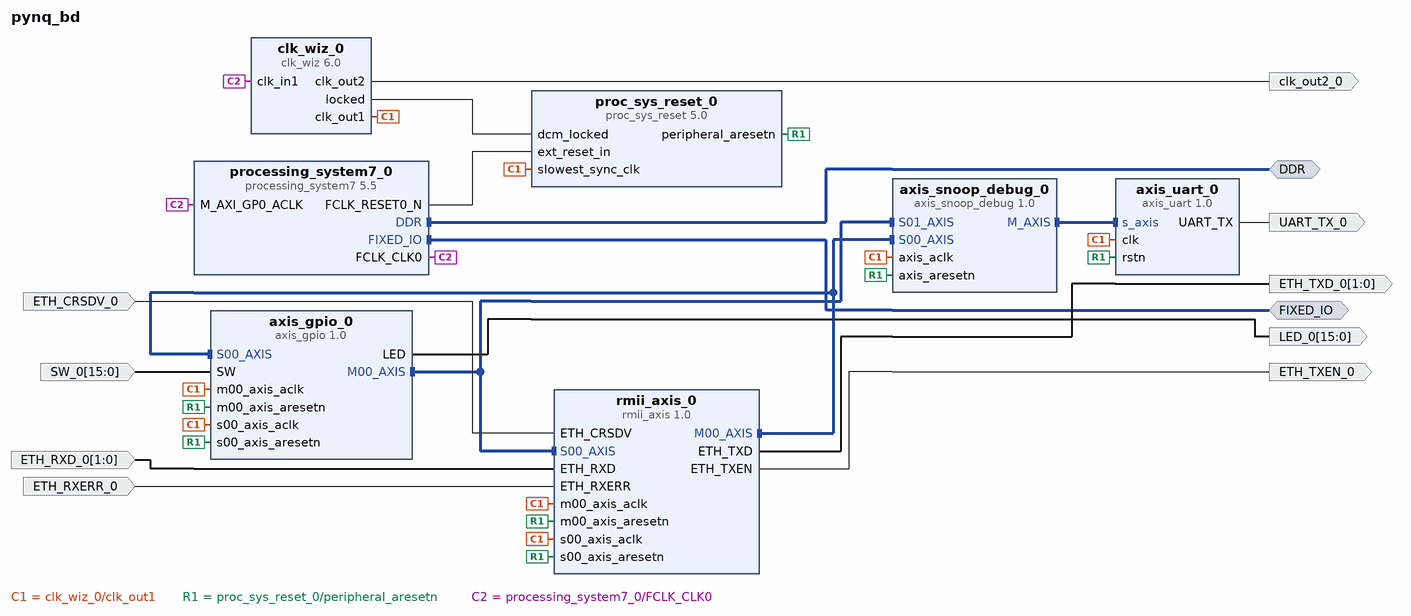
[diagram p0: block diagram of the top level]
# Vivado block design pynq_bd, xc7z020clg400-1, Vivado 2022.2
create_bd_design pynq_bd

create_bd_intf_port -mode Master -vlnv xilinx.com:interface:ddrx_rtl:1.0 DDR
create_bd_intf_port -mode Master -vlnv xilinx.com:display_processing_system7:fixedio_rtl:1.0 FIXED_IO
create_bd_port -dir O -type clk clk_out2_0
create_bd_port -dir O -from 1 -to 0 ETH_TXD_0
create_bd_port -dir O ETH_TXEN_0
create_bd_port -dir I ETH_CRSDV_0
create_bd_port -dir I ETH_RXERR_0
create_bd_port -dir I -from 1 -to 0 ETH_RXD_0
create_bd_port -dir O UART_TX_0
create_bd_port -dir I -from 15 -to 0 SW_0
create_bd_port -dir O -from 15 -to 0 LED_0

create_bd_cell -type ip -vlnv xilinx.com:ip:processing_system7:5.5 processing_system7_0
set_property -dict [list \
  CONFIG.PCW_APU_PERIPHERAL_FREQMHZ 650 \
  CONFIG.PCW_CRYSTAL_PERIPHERAL_FREQMHZ 50 \
  CONFIG.PCW_ENET0_ENET0_IO {MIO 16 .. 27} \
  CONFIG.PCW_ENET0_GRP_MDIO_ENABLE 1 \
  CONFIG.PCW_ENET0_GRP_MDIO_IO {MIO 52 .. 53} \
  CONFIG.PCW_ENET0_PERIPHERAL_ENABLE 1 \
  CONFIG.PCW_ENET0_RESET_ENABLE 1 \
  CONFIG.PCW_ENET0_RESET_IO {MIO 9} \
  CONFIG.PCW_ENET_RESET_ENABLE 1 \
  CONFIG.PCW_ENET_RESET_SELECT {Share reset pin} \
  CONFIG.PCW_FPGA0_PERIPHERAL_FREQMHZ 100 \
  CONFIG.PCW_FPGA1_PERIPHERAL_FREQMHZ 50 \
  CONFIG.PCW_GPIO_MIO_GPIO_ENABLE 1 \
  CONFIG.PCW_GPIO_MIO_GPIO_IO MIO \
  CONFIG.PCW_I2C_RESET_ENABLE 1 \
  CONFIG.PCW_M_AXI_GP0_FREQMHZ 10 \
  CONFIG.PCW_PERIPHERAL_BOARD_PRESET None \
  CONFIG.PCW_PRESET_BANK1_VOLTAGE {LVCMOS 1.8V} \
  CONFIG.PCW_QSPI_GRP_FBCLK_ENABLE 1 \
  CONFIG.PCW_QSPI_GRP_FBCLK_IO {MIO 8} \
  CONFIG.PCW_QSPI_GRP_SINGLE_SS_ENABLE 1 \
  CONFIG.PCW_QSPI_GRP_SINGLE_SS_IO {MIO 1 .. 6} \
  CONFIG.PCW_QSPI_PERIPHERAL_ENABLE 1 \
  CONFIG.PCW_QSPI_QSPI_IO {MIO 1 .. 6} \
  CONFIG.PCW_SD0_GRP_CD_ENABLE 1 \
  CONFIG.PCW_SD0_GRP_CD_IO {MIO 47} \
  CONFIG.PCW_SD0_GRP_WP_ENABLE 0 \
  CONFIG.PCW_SD0_PERIPHERAL_ENABLE 1 \
  CONFIG.PCW_SD0_SD0_IO {MIO 40 .. 45} \
  CONFIG.PCW_SDIO_PERIPHERAL_FREQMHZ 50 \
  CONFIG.PCW_SINGLE_QSPI_DATA_MODE x4 \
  CONFIG.PCW_UART0_PERIPHERAL_ENABLE 1 \
  CONFIG.PCW_UART0_UART0_IO {MIO 14 .. 15} \
  CONFIG.PCW_UART1_PERIPHERAL_ENABLE 0 \
  CONFIG.PCW_UART_PERIPHERAL_FREQMHZ 100 \
  CONFIG.PCW_UIPARAM_DDR_BUS_WIDTH {16 Bit} \
  CONFIG.PCW_UIPARAM_DDR_FREQ_MHZ 525 \
  CONFIG.PCW_UIPARAM_DDR_PARTNO {MT41J256M16 RE-125} \
  CONFIG.PCW_USB0_PERIPHERAL_ENABLE 1 \
  CONFIG.PCW_USB0_RESET_ENABLE 1 \
  CONFIG.PCW_USB0_RESET_IO {MIO 46} \
  CONFIG.PCW_USB0_USB0_IO {MIO 28 .. 39} \
  CONFIG.PCW_USB_RESET_ENABLE 1 \
  CONFIG.PCW_USB_RESET_SELECT {Share reset pin} \
] [get_bd_cells processing_system7_0]
# 481 more settings of processing_system7_0 are not shown: defaults, MIO pin electricals, DDR timing, and values the tool derives
create_bd_cell -type ip -vlnv FabianCastano:toolbox:rmii_axis:1.0 rmii_axis_0
set_property -dict [list \
  CONFIG.FPGA_IP_1 192 \
  CONFIG.FPGA_IP_2 168 \
  CONFIG.FPGA_IP_3 1 \
  CONFIG.FPGA_IP_4 25 \
  CONFIG.HOST_IP_1 192 \
  CONFIG.HOST_IP_2 168 \
  CONFIG.HOST_IP_3 1 \
  CONFIG.HOST_IP_4 4 \
] [get_bd_cells rmii_axis_0]
create_bd_cell -type ip -vlnv FabianCastano:toolbox:axis_snoop_debug:1.0 axis_snoop_debug_0
create_bd_cell -type ip -vlnv xilinx.com:ip:clk_wiz:6.0 clk_wiz_0
set_property -dict [list \
  CONFIG.CLKOUT1_JITTER 151.636 \
  CONFIG.CLKOUT1_REQUESTED_OUT_FREQ 50 \
  CONFIG.CLKOUT2_JITTER 151.636 \
  CONFIG.CLKOUT2_PHASE_ERROR 98.575 \
  CONFIG.CLKOUT2_REQUESTED_OUT_FREQ 50 \
  CONFIG.CLKOUT2_REQUESTED_PHASE 45 \
  CONFIG.CLKOUT2_USED true \
  CONFIG.MMCM_CLKOUT0_DIVIDE_F 20.000 \
  CONFIG.MMCM_CLKOUT1_DIVIDE 20 \
  CONFIG.MMCM_CLKOUT1_PHASE 45.000 \
  CONFIG.NUM_OUT_CLKS 2 \
  CONFIG.USE_RESET false \
] [get_bd_cells clk_wiz_0]
create_bd_cell -type ip -vlnv xilinx.com:ip:proc_sys_reset:5.0 proc_sys_reset_0
create_bd_cell -type ip -vlnv FabianCastano:toolbox:axis_gpio:1.0 axis_gpio_0
set_property -dict {CONFIG.GPIO_WIDTH 4} [get_bd_cells axis_gpio_0]
create_bd_cell -type ip -vlnv FabianCastano:toolbox:axis_uart:1.0 axis_uart_0

# ---- connections ----

connect_bd_intf_net [get_bd_intf_pins axis_gpio_0/M00_AXIS] [get_bd_intf_pins rmii_axis_0/S00_AXIS]
connect_bd_intf_net [get_bd_intf_pins axis_gpio_0/M00_AXIS] [get_bd_intf_pins axis_snoop_debug_0/S01_AXIS]
connect_bd_intf_net [get_bd_intf_pins axis_uart_0/s_axis] [get_bd_intf_pins axis_snoop_debug_0/M_AXIS]
connect_bd_intf_net [get_bd_intf_ports DDR] [get_bd_intf_pins processing_system7_0/DDR]
connect_bd_intf_net [get_bd_intf_ports FIXED_IO] [get_bd_intf_pins processing_system7_0/FIXED_IO]
connect_bd_intf_net [get_bd_intf_pins rmii_axis_0/M00_AXIS] [get_bd_intf_pins axis_gpio_0/S00_AXIS]
connect_bd_intf_net [get_bd_intf_pins rmii_axis_0/M00_AXIS] [get_bd_intf_pins axis_snoop_debug_0/S00_AXIS]
connect_bd_net -net ETH_CRSDV_0_1 [get_bd_ports ETH_CRSDV_0] [get_bd_pins rmii_axis_0/ETH_CRSDV]
connect_bd_net -net ETH_RXD_0_1 [get_bd_ports ETH_RXD_0] [get_bd_pins rmii_axis_0/ETH_RXD]
connect_bd_net -net ETH_RXERR_0_1 [get_bd_ports ETH_RXERR_0] [get_bd_pins rmii_axis_0/ETH_RXERR]
connect_bd_net -net SW_0_1 [get_bd_ports SW_0] [get_bd_pins axis_gpio_0/SW]
connect_bd_net [get_bd_pins axis_gpio_0/LED] [get_bd_ports LED_0]
connect_bd_net [get_bd_pins axis_uart_0/UART_TX] [get_bd_ports UART_TX_0]
connect_bd_net [get_bd_pins clk_wiz_0/clk_out1] \
  [get_bd_pins rmii_axis_0/m00_axis_aclk] [get_bd_pins rmii_axis_0/s00_axis_aclk] \
  [get_bd_pins proc_sys_reset_0/slowest_sync_clk] [get_bd_pins axis_snoop_debug_0/axis_aclk] \
  [get_bd_pins axis_gpio_0/s00_axis_aclk] [get_bd_pins axis_gpio_0/m00_axis_aclk] [get_bd_pins axis_uart_0/clk]
connect_bd_net [get_bd_pins clk_wiz_0/clk_out2] [get_bd_ports clk_out2_0]
connect_bd_net [get_bd_pins clk_wiz_0/locked] [get_bd_pins proc_sys_reset_0/dcm_locked]
connect_bd_net [get_bd_pins proc_sys_reset_0/peripheral_aresetn] \
  [get_bd_pins rmii_axis_0/s00_axis_aresetn] [get_bd_pins rmii_axis_0/m00_axis_aresetn] \
  [get_bd_pins axis_snoop_debug_0/axis_aresetn] [get_bd_pins axis_gpio_0/s00_axis_aresetn] \
  [get_bd_pins axis_gpio_0/m00_axis_aresetn] [get_bd_pins axis_uart_0/rstn]
connect_bd_net [get_bd_pins processing_system7_0/FCLK_CLK0] [get_bd_pins processing_system7_0/M_AXI_GP0_ACLK] [get_bd_pins clk_wiz_0/clk_in1]
connect_bd_net [get_bd_pins processing_system7_0/FCLK_RESET0_N] [get_bd_pins proc_sys_reset_0/ext_reset_in]
connect_bd_net [get_bd_pins rmii_axis_0/ETH_TXD] [get_bd_ports ETH_TXD_0]
connect_bd_net [get_bd_pins rmii_axis_0/ETH_TXEN] [get_bd_ports ETH_TXEN_0]

validate_bd_design
save_bd_design
